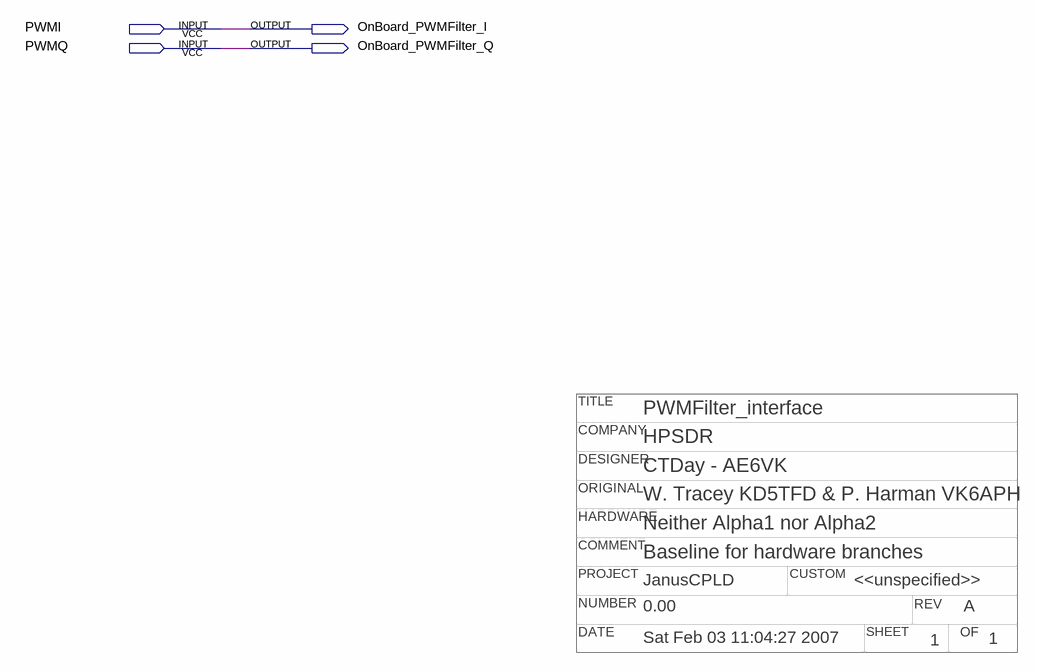
[diagram p0: schematic sheet]
// Quartus schematic PWMFilter_interface.bdf as structural Verilog: 0 symbols, 4 pins
// Title block: TITLE: PWMFilter_interface; COMPANY: HPSDR; DESIGNER: CTDay - AE6VK; NUMBER: 0.00; REV: A; DATE: Sat Feb 03 11:04:27 2007; SHEET: 1; OF: 1; ORIGINAL: W. Tracey KD5TFD & P. Harman VK6APH; HARDWARE: Neither Alpha1 nor Alpha2; COMMENT: Baseline for hardware branches; PROJECT: JanusCPLD; CUSTOM: <<unspecified>>
module PWMFilter_interface (
  input  PWMI,
  input  PWMQ,
  output OnBoard_PWMFilter_I,
  output OnBoard_PWMFilter_Q
);


  assign OnBoard_PWMFilter_I = PWMI;
  assign OnBoard_PWMFilter_Q = PWMQ;
endmodule
